# Altium schematic sheet RP_ComputeModule3_rev.3.0_Displays.SchDoc
size A4 portrait
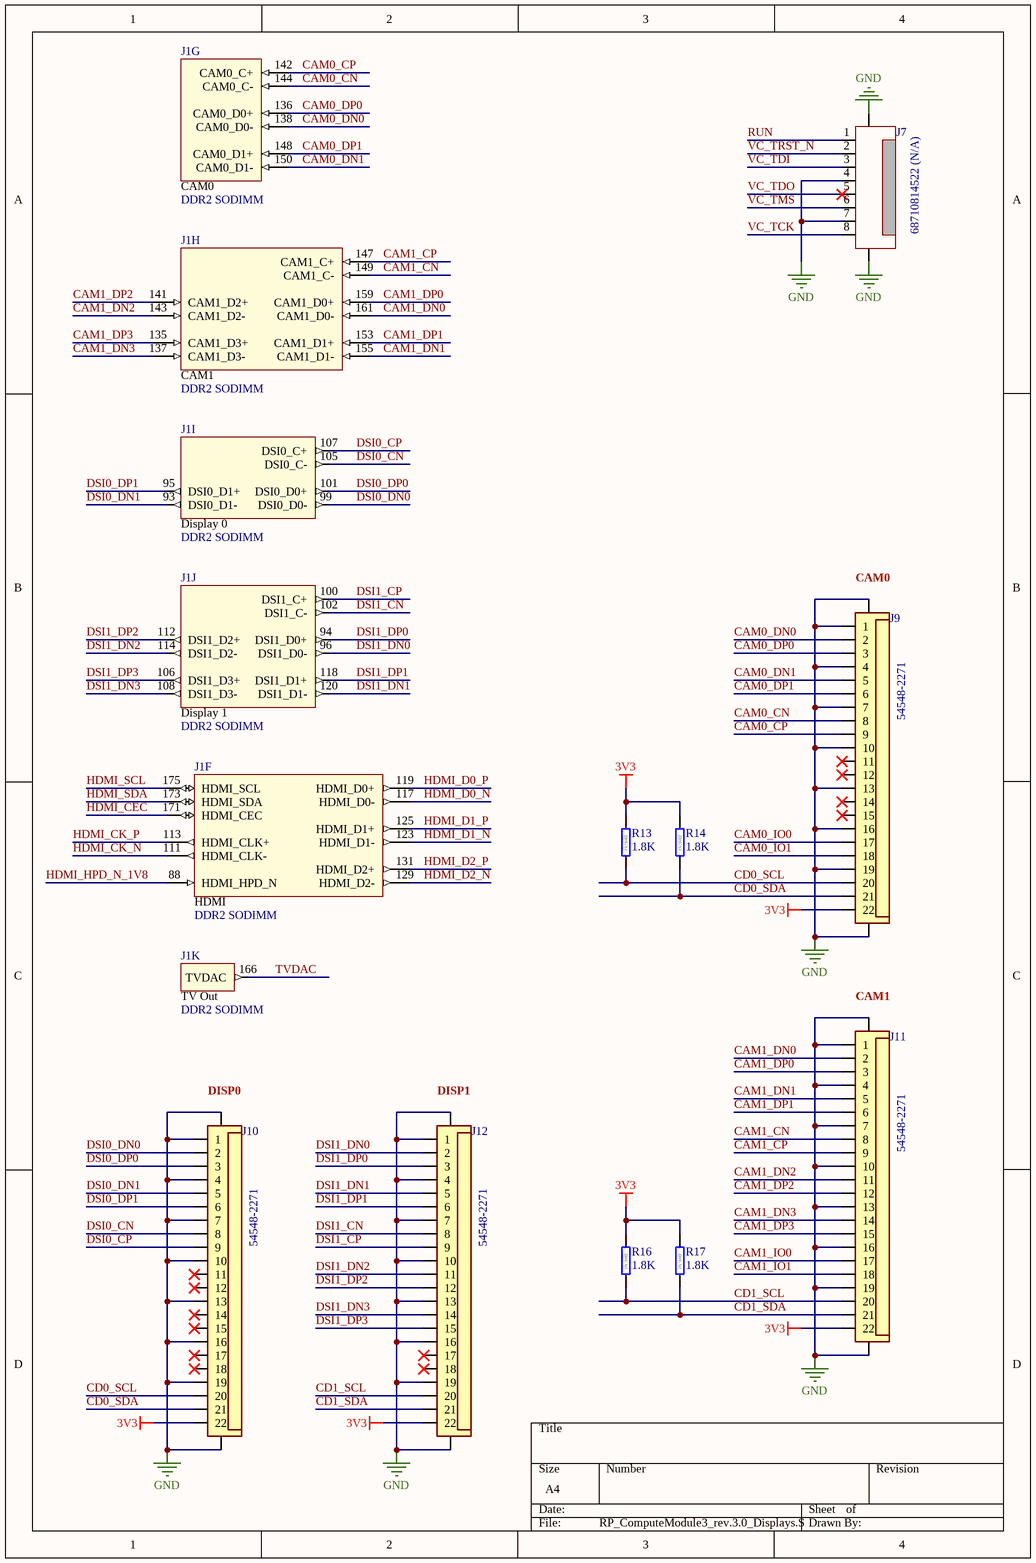
[diagram p0: RP_ComputeModule3_rev.3.0_Displays.SchDoc]

## Parts
J1  DDR2 SODIMM  [TE 1473005-4 (DDR2 SO-DIMM)]  (parts F,G,H,I,J,K of 14)
J7  68710814522 (N/A)  [WE 68710814522 N/A]  (no BOM)
J9  54548-2271  [Molex 54548-2271]
J10  54548-2271  [Molex 54548-2271]
J11  54548-2271  [Molex 54548-2271]
J12  54548-2271  [Molex 54548-2271]
R13  1.8K  [RES0402]
R14  1.8K  [RES0402]
R16  1.8K  [RES0402]
R17  1.8K  [RES0402]

## Nets
3V3: J9.22 J10.22 J11.22 J12.22 R13.1 R14.1 R16.1 R17.1
GND: J7.4 J7.7 J7.9 J7.10 J9.1 J9.4 J9.7 J9.10 J9.13 J9.16 J9.19 J9.G1 J9.G2 J10.1 J10.4 J10.7 J10.10 J10.13 J10.16 J10.19 J10.G1 J10.G2 J11.1 J11.4 J11.7 J11.10 J11.13 J11.16 J11.19 J11.G1 J11.G2 J12.1 J12.4 J12.7 J12.10 J12.13 J12.16 J12.19 J12.G1 J12.G2
CAM0_CN: J1.144(CAM0_C-) J9.8
CAM0_CP: J1.142(CAM0_C+) J9.9
CAM0_DN0: J1.138(CAM0_D0-) J9.2
CAM0_DN1: J1.150(CAM0_D1-) J9.5
CAM0_DP0: J1.136(CAM0_D0+) J9.3
CAM0_DP1: J1.148(CAM0_D1+) J9.6
CAM0_IO0: J9.17
CAM0_IO1: J9.18
CAM1_CN: J1.149(CAM1_C-) J11.8
CAM1_CP: J1.147(CAM1_C+) J11.9
CAM1_DN0: J1.161(CAM1_D0-) J11.2
CAM1_DN1: J1.155(CAM1_D1-) J11.5
CAM1_DN2: J1.143(CAM1_D2-) J11.11
CAM1_DN3: J1.137(CAM1_D3-) J11.14
CAM1_DP0: J1.159(CAM1_D0+) J11.3
CAM1_DP1: J1.153(CAM1_D1+) J11.6
CAM1_DP2: J1.141(CAM1_D2+) J11.12
CAM1_DP3: J1.135(CAM1_D3+) J11.15
CAM1_IO0: J11.17
CAM1_IO1: J11.18
CD0_SCL: J9.20 J10.20 R13.2
CD0_SDA: J9.21 J10.21 R14.2
CD1_SCL: J11.20 J12.20 R16.2
CD1_SDA: J11.21 J12.21 R17.2
DSI0_CN: J1.105(DSI0_C-) J10.8
DSI0_CP: J1.107(DSI0_C+) J10.9
DSI0_DN0: J1.99(DSI0_D0-) J10.2
DSI0_DN1: J1.93(DSI0_D1-) J10.5
DSI0_DP0: J1.101(DSI0_D0+) J10.3
DSI0_DP1: J1.95(DSI0_D1+) J10.6
DSI1_CN: J1.102(DSI1_C-) J12.8
DSI1_CP: J1.100(DSI1_C+) J12.9
DSI1_DN0: J1.96(DSI1_D0-) J12.2
DSI1_DN1: J1.120(DSI1_D1-) J12.5
DSI1_DN2: J1.114(DSI1_D2-) J12.11
DSI1_DN3: J1.108(DSI1_D3-) J12.14
DSI1_DP0: J1.94(DSI1_D0+) J12.3
DSI1_DP1: J1.118(DSI1_D1+) J12.6
DSI1_DP2: J1.112(DSI1_D2+) J12.12
DSI1_DP3: J1.106(DSI1_D3+) J12.15
HDMI_CEC: J1.171(HDMI_CEC)
HDMI_CK_N: J1.111(HDMI_CLK-)
HDMI_CK_P: J1.113(HDMI_CLK+)
HDMI_D0_N: J1.117(HDMI_D0-)
HDMI_D0_P: J1.119(HDMI_D0+)
HDMI_D1_N: J1.123(HDMI_D1-)
HDMI_D1_P: J1.125(HDMI_D1+)
HDMI_D2_N: J1.129(HDMI_D2-)
HDMI_D2_P: J1.131(HDMI_D2+)
HDMI_HPD_N_1V8: J1.88(HDMI_HPD_N)
HDMI_SCL: J1.175(HDMI_SCL)
HDMI_SDA: J1.173(HDMI_SDA)
RUN: J7.1
TVDAC: J1.166(TVDAC)
VC_TCK: J7.8
VC_TDI: J7.3
VC_TDO: J7.5
VC_TMS: J7.6
VC_TRST_N: J7.2

Not connected (* = marked no-connect by the designer): J9 11* 12* 14* 15*; J10 11* 12* 14* 15* 17* 18*; J12 17* 18*

## Notes on the sheet
- (near J9) CAM0
- (near J11) CAM1
- (near J10) DISP0
- (near J12) DISP1
- (in symbol 1473005-4, part F) HDMI
- (in symbol 1473005-4, part G) CAM0
- (in symbol 1473005-4, part H) CAM1
- (in symbol 1473005-4, part I) Display 0
- (in symbol 1473005-4, part J) Display 1
- (in symbol 1473005-4, part K) TV Out
- (in symbol RK73H1ETTP1801F) 1% | 0402

## Library data of the parts
J1 = 1473005-4: TE CONNECTIVITY / AMP         1473005-4             SOCKET IC, DIMM, DDR2, 1.8V, 200WAY; Number of Contacts: 200; Memory Type: SDRAM,DDR; Insulation Resistance: 250MR; PCB Mount Retention: With; Gender: Female; Contact Current Rating: 500mA; Circuit Application: Power; Connector System: Cable-to-Board; Sealable: No (Without); Pitch: 0.6mm; Row Spacing: 0.244inch; Stack Height: 5.2mm; Supplier 1: Digi-Key; Manufacturer: TE Connectivity; Manufacturer Part Number: 1473005-4; Stock 1: 3804; Pricing 1: 1=3.9, 10=3.744, 25=3.432, 50=3.276, 100=3.12, 250=2.73, 500=2.652, 1000=2.262, 2500=2.106 (USD); Mount: Surface Mount; Number of Pins: 200; Contact Material: Copper Alloy; Contact Plating: Gold; Housing Colour: Black; Housing Material: Thermoplastic; Insulation Material: Thermoplastic; Min Operating Temperature: -67°C; Max Operating Temperature: 185°C; Number of Rows: 2; Orientation: Right Angle; Termination: Solder; Packaging: Tray; Package Quantity: 20; Number of Positions: 200; Voltage Rating: 1.8V; Connector Type: Socket; Length: 71.5mm; Depth: 26mm; Radiation Hardening: No; ELV: Compliant; Flammability Rating: UL94 V-0; Lead Free: Lead Free; REACH SVHC: No SVHC; ComponentLink1URL: https://datasheet.ciiva.com/682/eng-cd-1473005-j2-682720.pdf; ComponentLink1Description: https://datasheet.ciiva.com/682/eng-cd-1473005-j2-682720.pdf; ComponentLink2URL: https://datasheet.ciiva.com/15171/getdatasheetpartid-99150-15171488.pdf; ComponentLink2Description: https://datasheet.ciiva.com/15171/getdatasheetpartid-99150-15171488.pdf; ComponentLink3URL: https://datasheet.ciiva.com/1105/582309-1105221.pdf; ComponentLink3Description: https://datasheet.ciiva.com/1105/582309-1105221.pdf; ComponentLink4URL: https://datasheet.ciiva.com/682/eng-cd-1473005-j2-682726.pdf; ComponentLink4Description: https://datasheet.ciiva.com/682/eng-cd-1473005-j2-682726.pdf; ComponentLink5URL: https://datasheet.ciiva.com/14156/04821302-14156311.pdf; ComponentLink5Description: https://datasheet.ciiva.com/14156/04821302-14156311.pdf; ComponentLink6URL: https://datasheet.ciiva.com/3136/eng-cd-1473005-j-3136060.pdf; ComponentLink6Description: https://datasheet.ciiva.com/3136/eng-cd-1473005-j-3136060.pdf; ComponentLink7URL: https://datasheet.ciiva.com/16380/eng-cd-1473005-j-16380909.pdf; ComponentLink7Description: https://datasheet.ciiva.com/16380/eng-cd-1473005-j-16380909.pdf; ComponentLink8URL: https://datasheet.ciiva.com/16651/eng-cd-1473005-j-16651646.pdf; ComponentLink8Description: https://datasheet.ciiva.com/16651/eng-cd-1473005-j-16651646.pdf
J7 = 68710814522_N/A: CONN FPC BOTTOM 8POS 0.50MM R/A; Manufacturer: Wurth Electronics; Actuator Material: Polymer,Liquid Crystal Polymer; Current Rating: 500mA; Voltage Rating: 50V; Number of Positions: 8; Insulation Resistance: 100MR; Gender: Male; Pitch: 0.5mm; Supplier 1: Mouser; Manufacturer Part Number: 68710814522; Stock 1: 2190; Pricing 1: 1=1.02, 10=0.991, 50=0.923, 100=0.854, 1000=0.718, 10000=0.635 (USD); Mount: Surface Mount; Contact Material: Bronze,Tin; Contact Plating: Tin; Housing Material: Liquid Crystal Polymer; Min Operating Temperature: -25°C; Max Operating Temperature: 85°C; Number of Rows: 1; Packaging: Tape and Reel; Package Quantity: 2000; Contact Location: Bottom; Termination: SMD/SMT; Number of Contacts: 8; Orientation: Straight; Length: 10.4mm; Width: 2.1mm; REACH SVHC: Unknown; Flammability Rating: UL94 V-0; ComponentLink1URL: https://datasheet.ciiva.com/670/6871xx14522-670726.pdf; ComponentLink1Description: https://datasheet.ciiva.com/670/6871xx14522-670726.pdf; ComponentLink2URL: https://datasheet.ciiva.com/670/6871xx14522-670727.pdf; ComponentLink2Description: https://datasheet.ciiva.com/670/6871xx14522-670727.pdf; ComponentLink3URL: https://datasheet.ciiva.com/670/6871xx14522-670728.pdf; ComponentLink3Description: https://datasheet.ciiva.com/670/6871xx14522-670728.pdf; ComponentLink4URL: https://datasheet.ciiva.com/14153/6871xx14522-eng-datasheet-14153886.pdf; ComponentLink4Description: https://datasheet.ciiva.com/14153/6871xx14522-eng-datasheet-14153886.pdf; ComponentLink5URL: https://datasheet.ciiva.com/29318/709082-da-01-en-smd-zif-stecker-90grad-kontakte-unten-8-29318044.pdf; ComponentLink5Description: https://datasheet.ciiva.com/29318/709082-da-01-en-smd-zif-stecker-90grad-kontakte-unten-8-29318044.pdf
J9-J12 = 0545482271: Conn FFC/FPC Connector SKT 22 POS 0.5mm Solder RA SMD Easy-On™ T/R; Manufacturer: Molex; Actuator Material: Polyphenylene; Voltage Rating: 50V; Current Rating: 500mA; Number of Positions: 22; Contact Resistance: 40mR; Wire/Cable Type: Straight; Supplier 1: Mouser; Manufacturer Part Number: 0545482271; Stock 1: 2798; Pricing 1: 1=2.25, 10=1.98, 50=1.98, 100=1.8, 1000=1.31, 10000=1.17 (USD); Mount: Surface Mount; Contact Material: Bronze; Contact Plating: Nickel,Gold; Housing Material: Polymer; Min Operating Temperature: -20°C; Max Operating Temperature: 85°C; Package Quantity: 1; Packaging: Tape and Reel; Number of Rows: 1; Termination: Solder; Orientation: Right Angle; Number of Contacts: 22; Length: 16.2mm; Pitch: 0.5mm; Depth: 5mm; Flammability Rating: UL94 V-0; ComponentLink1URL: https://datasheet.ciiva.com/3926/187910545482271-ffc-fpc-nectors-3926715.pdf; ComponentLink1Description: https://datasheet.ciiva.com/3926/187910545482271-ffc-fpc-nectors-3926715.pdf; ComponentLink2URL: https://datasheet.ciiva.com/3112/0545482271-ffc-fpc-connectors-3112285.pdf; ComponentLink2Description: https://datasheet.ciiva.com/3112/0545482271-ffc-fpc-connectors-3112285.pdf; ComponentLink3URL: https://datasheet.ciiva.com/6944/545482671-sd-6944776.pdf; ComponentLink3Description: https://datasheet.ciiva.com/6944/545482671-sd-6944776.pdf; ComponentLink4URL: https://datasheet.ciiva.com/6944/545482671-sd-6944780.pdf; ComponentLink4Description: https://datasheet.ciiva.com/6944/545482671-sd-6944780.pdf
R13 R14 R16 R17 = RK73H1ETTP1801F: Thick Film Resistors - SMD 1.8K OHM 1%; Manufacturer: KOA Speer; Resistance: 1.8kR; Power Rating: 63mW; Voltage Rating: 50V; Temperature Coefficient: 100ppm/°C; Supplier 1: Mouser; Manufacturer Part Number: RK73H1ETTP1801F; Stock 1: 3595; Pricing 1: 1=0.11, 10=0.027, 50=0.027, 100=0.007, 1000=0.005, 10000=0.004 (USD); Case/Package: 0402; Case Code (Imperial): 0402; Case Code (Metric): 1005; Min Operating Temperature: -55°C; Max Operating Temperature: 155°C; Packaging: Tape and Reel; Tolerance: 1%; Package Quantity: 10000; Composition: Thick Film; Termination: SMD/SMT; Military Standard: Not; Length: 1mm; Height: 0.35mm; Width: 0.5mm; Depth: 0.5mm; Lead Free: Lead Free; ComponentLink1URL: https://datasheet.ciiva.com/5553/rk73h-5715-5553193.pdf; ComponentLink1Description: https://datasheet.ciiva.com/5553/rk73h-5715-5553193.pdf